# Altium schematic sheet DAQ.SchDoc: DAQ Master
size A4; Date: 21.10.2016; Engineer: Matjaz Tome; DocumentNumber: 2; Revision: B1; SheetNumber: 2; SheetTotal: 8; Project: USB DAQ
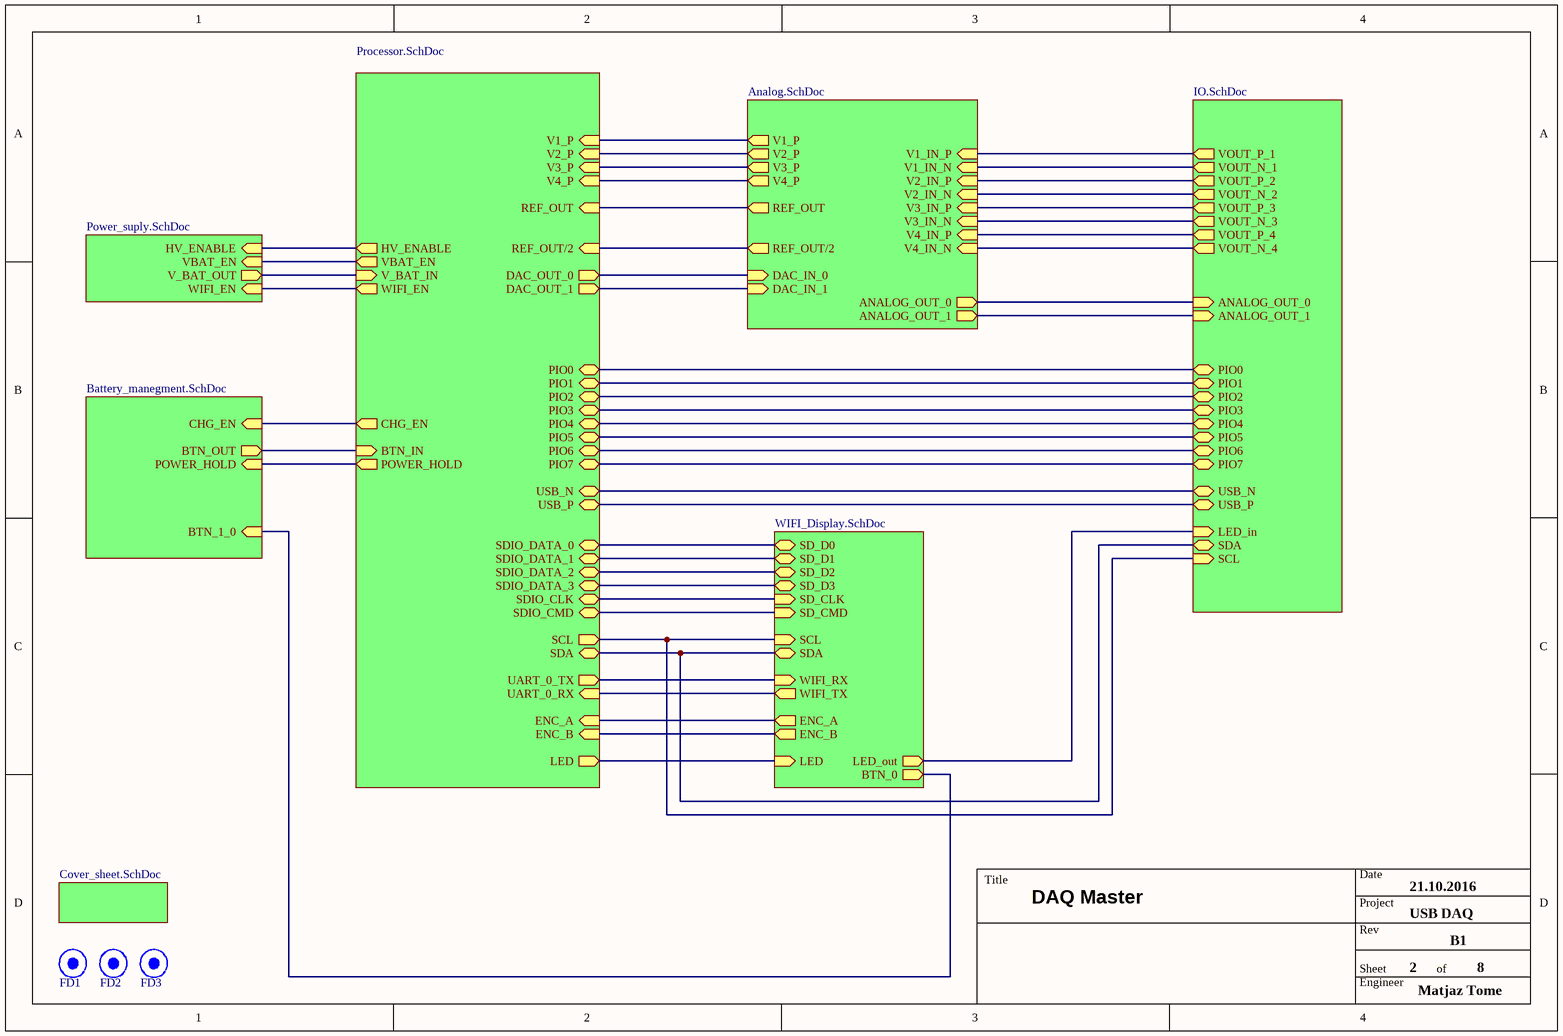
[diagram p0: DAQ.SchDoc]

## Parts
FD1  Fiducial 1mm  [FID1]  (value not drawn)  (no BOM)
FD2  Fiducial 1mm  [FID1]  (value not drawn)  (no BOM)
FD3  Fiducial 1mm  [FID1]  (value not drawn)  (no BOM)

## Sub-sheets
? = Processor.SchDoc: PIO0 (bidir), PIO1 (bidir), PIO2 (bidir), PIO3 (bidir), PIO4 (bidir), PIO5 (bidir), PIO6 (bidir), PIO7 (bidir), V3_P (in), V4_P (in), V1_P (in), V2_P (in), USB_N (bidir), USB_P (bidir), DAC_OUT_0 (out), DAC_OUT_1 (out), REF_OUT/2 (in), REF_OUT (in), HV_ENABLE (out), SDIO_DATA_0 (bidir), SDIO_DATA_1 (bidir), SDIO_DATA_2 (bidir), SDIO_DATA_3 (bidir), SDIO_CLK (bidir), SDIO_CMD (bidir), UART_0_TX (out), UART_0_RX (in), SCL (out), SDA (bidir), POWER_HOLD (out), V_BAT_IN (in), ENC_A (in), ENC_B (in), WIFI_EN (out), VBAT_EN (out), BTN_IN (in), LED (out), CHG_EN (out)
? = Analog.SchDoc: V1_IN_P (in), V1_IN_N (in), V2_IN_N (in), V3_IN_N (in), V4_IN_N (in), V4_IN_P (in), V3_IN_P (in), V2_IN_P (in), REF_OUT/2 (out), DAC_IN_0 (in), DAC_IN_1 (in), ANALOG_OUT_0 (out), ANALOG_OUT_1 (out), V1_P (out), V2_P (out), V3_P (out), V4_P (out), REF_OUT (out)
? = IO.SchDoc: PIO0 (bidir), PIO1 (bidir), PIO2 (bidir), PIO3 (bidir), PIO4 (bidir), PIO5 (bidir), PIO6 (bidir), PIO7 (bidir), VOUT_N_1 (out), VOUT_N_2 (out), VOUT_N_3 (out), VOUT_N_4 (out), VOUT_P_1 (out), VOUT_P_2 (out), VOUT_P_3 (out), VOUT_P_4 (out), ANALOG_OUT_0 (in), ANALOG_OUT_1 (in), USB_N (bidir), USB_P (bidir), SDA (bidir), SCL (in), LED_in (in)
? = Power_suply.SchDoc: HV_ENABLE (in), VBAT_EN (in), V_BAT_OUT (out), WIFI_EN (in)
? = Battery_manegment.SchDoc: BTN_OUT (out), POWER_HOLD (in), BTN_1_0 (in), CHG_EN (in)
? = WIFI_Display.SchDoc: SD_CLK (in), ENC_B (out), BTN_0 (out), WIFI_RX (in), ENC_A (out), SD_D2 (bidir), SD_D3 (bidir), SDA (bidir), SCL (in), SD_D1 (bidir), WIFI_TX (out), SD_D0 (bidir), SD_CMD (in), LED (in), LED_out (out)
? = Cover_sheet.SchDoc: no entries

## Nets
(unnamed): sheet /PIO0, sheet /PIO0
(unnamed): sheet /PIO1, sheet /PIO1
(unnamed): sheet /PIO2, sheet /PIO2
(unnamed): sheet /PIO3, sheet /PIO3
(unnamed): sheet /PIO4, sheet /PIO4
(unnamed): sheet /PIO5, sheet /PIO5
(unnamed): sheet /PIO6, sheet /PIO6
(unnamed): sheet /PIO7, sheet /PIO7
(unnamed): sheet /V3_P, sheet /V3_P
(unnamed): sheet /V4_P, sheet /V4_P
(unnamed): sheet /V1_P, sheet /V1_P
(unnamed): sheet /V2_P, sheet /V2_P
(unnamed): sheet /USB_N, sheet /USB_N
(unnamed): sheet /USB_P, sheet /USB_P
(unnamed): sheet /DAC_OUT_0, sheet /DAC_IN_0
(unnamed): sheet /DAC_OUT_1, sheet /DAC_IN_1
(unnamed): sheet /REF_OUT/2, sheet /REF_OUT/2
(unnamed): sheet /REF_OUT, sheet /REF_OUT
(unnamed): sheet /HV_ENABLE, sheet /HV_ENABLE
(unnamed): sheet /SDIO_DATA_0, sheet /SD_D0
(unnamed): sheet /SDIO_DATA_1, sheet /SD_D1
(unnamed): sheet /SDIO_DATA_2, sheet /SD_D2
(unnamed): sheet /SDIO_DATA_3, sheet /SD_D3
(unnamed): sheet /SDIO_CLK, sheet /SD_CLK
(unnamed): sheet /SDIO_CMD, sheet /SD_CMD
(unnamed): sheet /UART_0_TX, sheet /WIFI_RX
(unnamed): sheet /UART_0_RX, sheet /WIFI_TX
(unnamed): sheet /SCL, sheet /SCL, sheet /SCL
(unnamed): sheet /SDA, sheet /SDA, sheet /SDA
(unnamed): sheet /POWER_HOLD, sheet /POWER_HOLD
(unnamed): sheet /V_BAT_IN, sheet /V_BAT_OUT
(unnamed): sheet /ENC_A, sheet /ENC_A
(unnamed): sheet /ENC_B, sheet /ENC_B
(unnamed): sheet /WIFI_EN, sheet /WIFI_EN
(unnamed): sheet /VBAT_EN, sheet /VBAT_EN
(unnamed): sheet /BTN_IN, sheet /BTN_OUT
(unnamed): sheet /LED, sheet /LED
(unnamed): sheet /CHG_EN, sheet /CHG_EN
(unnamed): sheet /V1_IN_P, sheet /VOUT_P_1
(unnamed): sheet /V1_IN_N, sheet /VOUT_N_1
(unnamed): sheet /V2_IN_N, sheet /VOUT_N_2
(unnamed): sheet /V3_IN_N, sheet /VOUT_N_3
(unnamed): sheet /V4_IN_N, sheet /VOUT_N_4
(unnamed): sheet /V4_IN_P, sheet /VOUT_P_4
(unnamed): sheet /V3_IN_P, sheet /VOUT_P_3
(unnamed): sheet /V2_IN_P, sheet /VOUT_P_2
(unnamed): sheet /ANALOG_OUT_0, sheet /ANALOG_OUT_0
(unnamed): sheet /ANALOG_OUT_1, sheet /ANALOG_OUT_1
(unnamed): sheet /LED_in, sheet /LED_out
(unnamed): sheet /BTN_1_0, sheet /BTN_0

## Notes on the sheet
- Title
- Date
- Project
- Rev
- Engineer
- Sheet
- of

## Library data of the parts
FD1-FD3 = XXC0016: Part Number: XXC0016; Category: Fiducials